# Altium project MBfnPiNeo.PrjPcb
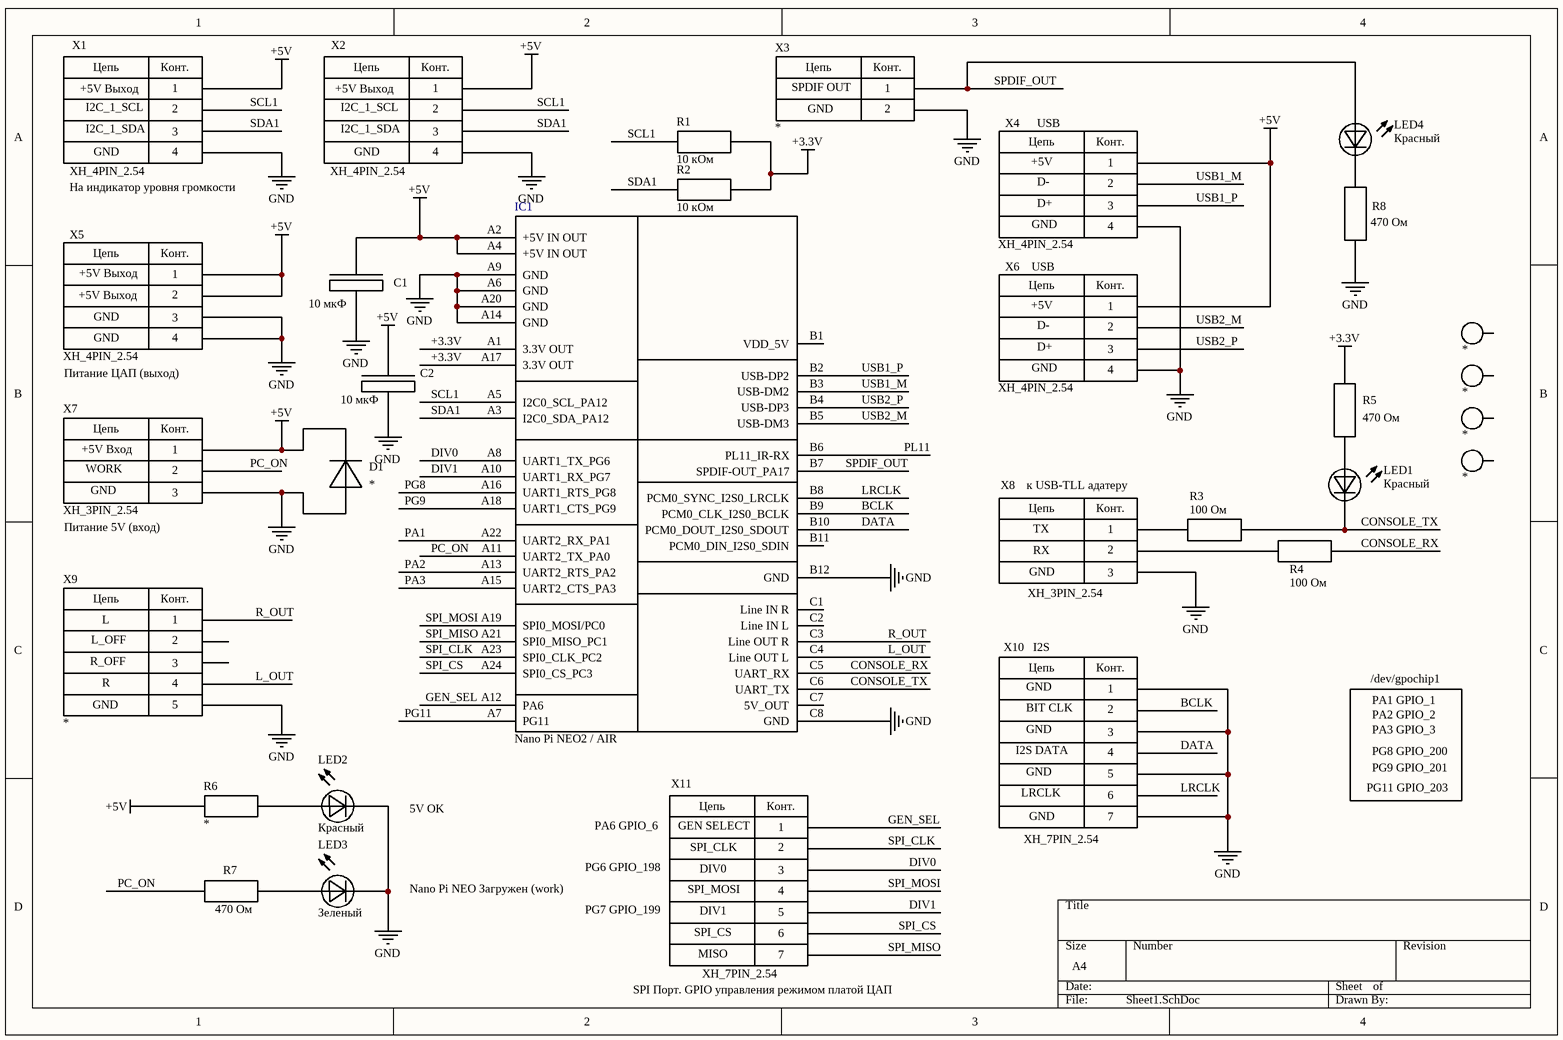
[diagram p0: Sheet1.SchDoc]
1 sheet, 31 parts. Net scope: global (net labels, ports and power ports of the same name join across sheets).
Board file: PCB1.PcbDoc

## Sheet Sheet1.SchDoc
size A4

### Parts
C1  10 мкФ  [Конденсатор SMD тантал 4x7]
C2  10 мкФ  [Конденсатор SMD тантал 4x7]
D1  *  [Диод SS14]
H1  *  [Отверстие 3,2]
H2  *  [Отверстие 3,2]
H3  *  [Отверстие 3,2]
H4  *  [Отверстие 3,2]
IC1  Nano Pi NEO2 / AIR  [NANOPI_NEO]
LED1  Красный  [Светодиод 3mm]
LED2  Красный  [Светодиод 3mm]
LED3  Зеленый  [Светодиод 3mm]
LED4  Красный  [Светодиод 3mm]
R1  10 кОм  [SMD 1206 Резистор]
R2  10 кОм  [SMD 1206 Резистор]
R3  100 Ом  [SMD 1206 Резистор]
R4  100 Ом  [SMD 1206 Резистор]
R5  470 Ом  [SMD 1206 Резистор]
R6  *  [SMD 1206 Резистор]
R7  470 Ом  [SMD 1206 Резистор]
R8  470 Ом  [SMD 1206 Резистор]
X1  XH_4PIN_2.54  [(1x4) PIN XH 2.54 HEADR]
X2  XH_4PIN_2.54  [(1x4) PIN XH 2.54 HEADR]
X3  *  [(1x2) PIN XH 2.54 header]
X4  XH_4PIN_2.54  [(1x4) PIN XH 2.54 HEADR]
X5  XH_4PIN_2.54  [(1x4) PIN XH 2.54 HEADR]
X6  XH_4PIN_2.54  [(1x4) PIN XH 2.54 HEADR]
X7  XH_3PIN_2.54  [(1x3) PIN XH 2.54 HEADR]
X8  XH_3PIN_2.54  [(1x3) PIN XH 2.54 HEADR]
X9  *  [3.5 Audio jack mama]
X10  XH_7PIN_2.54  [(1x7) PIN XH 2.54 HEADR]
X11  XH_7PIN_2.54  [(1x7) PIN XH 2.54 HEADR]

### Nets
+3.3V: IC1.A1(3.3V_OUT) IC1.A17(3.3V_OUT) R1.1(left) R2.1(left) R5.1(left)
+5V: C1.1 C2.1 D1.2(K) IC1.A2(+5V_IN_OUT) IC1.A4(+5V_IN_OUT) R6.2(right) X1.1 X2.1 X4.1 X5.1 X5.2 X6.1 X7.1
GND: C1.2 C2.2 D1.1(А) IC1.A6(GND) IC1.A9(GND) IC1.A14(GND) IC1.A20(GND) IC1.B12(GND) IC1.C8(GND) LED2.2(K) LED3.2(K) R8.2(right) X1.4 X2.4 X3.2 X4.4 X5.3 X5.4 X6.4 X7.3 X8.3 X9.5 X10.1 X10.3 X10.5 X10.7
BCLK: IC1.B9(PCM0_CLK_I2S0_BCLK) X10.2
CONSOLE_RX: IC1.C5(UART_RX) R4.1(left)
CONSOLE_TX: IC1.C6(UART_TX) LED1.2(K) R3.1(left)
DATA: IC1.B10(PCM0_DOUT_I2S0_SDOUT) X10.4
DIV0: IC1.A8(UART1_TX_PG6) X11.3
DIV1: IC1.A10(UART1_RX_PG7) X11.5
GEN_SEL: IC1.A12(PA6) X11.1
L_OUT: IC1.C4(Line_OUT_L) X9.4
LRCLK: IC1.B8(PCM0_SYNC_I2S0_LRCLK) X10.6
PA1: IC1.A22(UART2_RX_PA1)
PA2: IC1.A13(UART2_RTS_PA2)
PA3: IC1.A15(UART2_CTS_PA3)
PC_ON: IC1.A11(UART2_TX_PA0) R7.2(right) X7.2
PG8: IC1.A16(UART1_RTS_PG8)
PG9: IC1.A18(UART1_CTS_PG9)
PG11: IC1.A7(PG11)
PL11: IC1.B6(PL11_IR-RX)
R_OUT: IC1.C3(Line_OUT_R) X9.1
SCL1: IC1.A5(I2C0_SCL_PA12) R1.2(right) X1.2 X2.2
SDA1: IC1.A3(I2C0_SDA_PA12) R2.2(right) X1.3 X2.3
SPDIF_OUT: IC1.B7(SPDIF-OUT_PA17) LED4.1(А) X3.1
SPI_CLK: IC1.A23(SPI0_CLK_PC2) X11.2
SPI_CS: IC1.A24(SPI0_CS_PC3) X11.6
SPI_MISO: IC1.A21(SPI0_MISO_PC1) X11.7
SPI_MOSI: IC1.A19(SPI0_MOSI/PС0) X11.4
USB1_M: IC1.B3(USB-DM2) X4.2
USB1_P: IC1.B2(USB-DP2) X4.3
USB2_M: IC1.B5(USB-DM3) X6.2
USB2_P: IC1.B4(USB-DP3) X6.3
NetLED1_1: LED1.1(А) R5.2(right)
NetLED2_1: LED2.1(А) R6.1(left)
NetLED3_1: LED3.1(А) R7.1(left)
NetLED4_2: LED4.2(K) R8.1(left)
NetR3_2: R3.2(right) X8.1
NetR4_2: R4.2(right) X8.2

Not connected (* = marked no-connect by the designer): H1 1; H2 1; H3 1; H4 1; IC1 B1(VDD_5V) B11(PCM0_DIN_I2S0_SDIN) C1(Line_IN_R) C2(Line_IN_L) C7(5V_OUT); X9 2 3

### Notes on the sheet
- +5V Выход
- SPDIF OUT
- GND
- +5V
- USB
- (near X1) На индикатор уровня громкости
- (near X5) Питание ЦАП (выход)
- +5V Вход
- WORK
- (near X8) к USB-TLL адатеру
- (near X7) Питание 5V (вход)
- TX
- RX
- I2S
- BIT CLK
- /dev/gpochip1
- PA2 GPIO_2
- PA1 GPIO_1
- I2S DATA
- PG11 GPIO_203
- PA3 GPIO_3
- PG8 GPIO_200
- PG9 GPIO_201
- 5V OK
- PA6 GPIO_6
- GEN SELECT
- SPI_CLK
- LRCLK
- Nano Pi NEO Загружен (work)
- PG6 GPIO_198
- PG7 GPIO_199
- SPI_MOSI
- DIV0
- DIV1
- (near X11) SPI Порт. GPIO управления режимом платой ЦАП
- SPI_CS
- MISO
- Labels drawn without touching a wire or pin: D+, D-, GND, I2C_1_SCL, I2C_1_SDA
- (in symbol 3.5 Audio) Цепь; Конт.; L; L_OFF; R_OFF; R; GND
- (in symbol (1x2)pin 2.54 Header) Цепь; Конт.
- (in symbol (1x3)pin 2.54 Header) Цепь; Конт.
- (in symbol (1x4) pin XH 2.54 Header) Цепь; Конт.
- (in symbol (1x7) pin 2.54 Header) Цепь; Конт.

### Library data of the parts
C1 C2 = Конденсатор: Value: 10 мкФ; Case: *
D1 = Диод: Value: *; Case: *
H1-H4 = Отверстие монтажное: Value: *
IC1 = NanoPi NEO: Value: Nano Pi NEO2 / AIR; Case: -
LED1-LED4 = Светодиод: Case: 3мм
  LED1 LED2 LED4: Value: Красный
  LED3: Value: Зеленый
R1-R8 = Резистор
  R1 R2: Case: SMD 1206; Value: 10 кОм
  R3 R4: Case: SMD 1206; Value: 100 Ом
  R5 R7 R8: Case: SMD 1206; Value: 470 Ом
  R6: Case: *; Value: *
X1 X2 X4-X6 = (1x4) pin XH 2.54 Header: Value: XH_4PIN_2.54
  X1 X2: Case: XH 4PIN
X3 = (1x2)pin 2.54 Header: Value: *; Case: *
X7 X8 = (1x3)pin 2.54 Header: Value: XH_3PIN_2.54; Case: XH 3PIN
X9 = 3.5 Audio: Value: *; Case: *
X10 X11 = (1x7) pin 2.54 Header: Value: XH_7PIN_2.54; Case: XH 7PIN